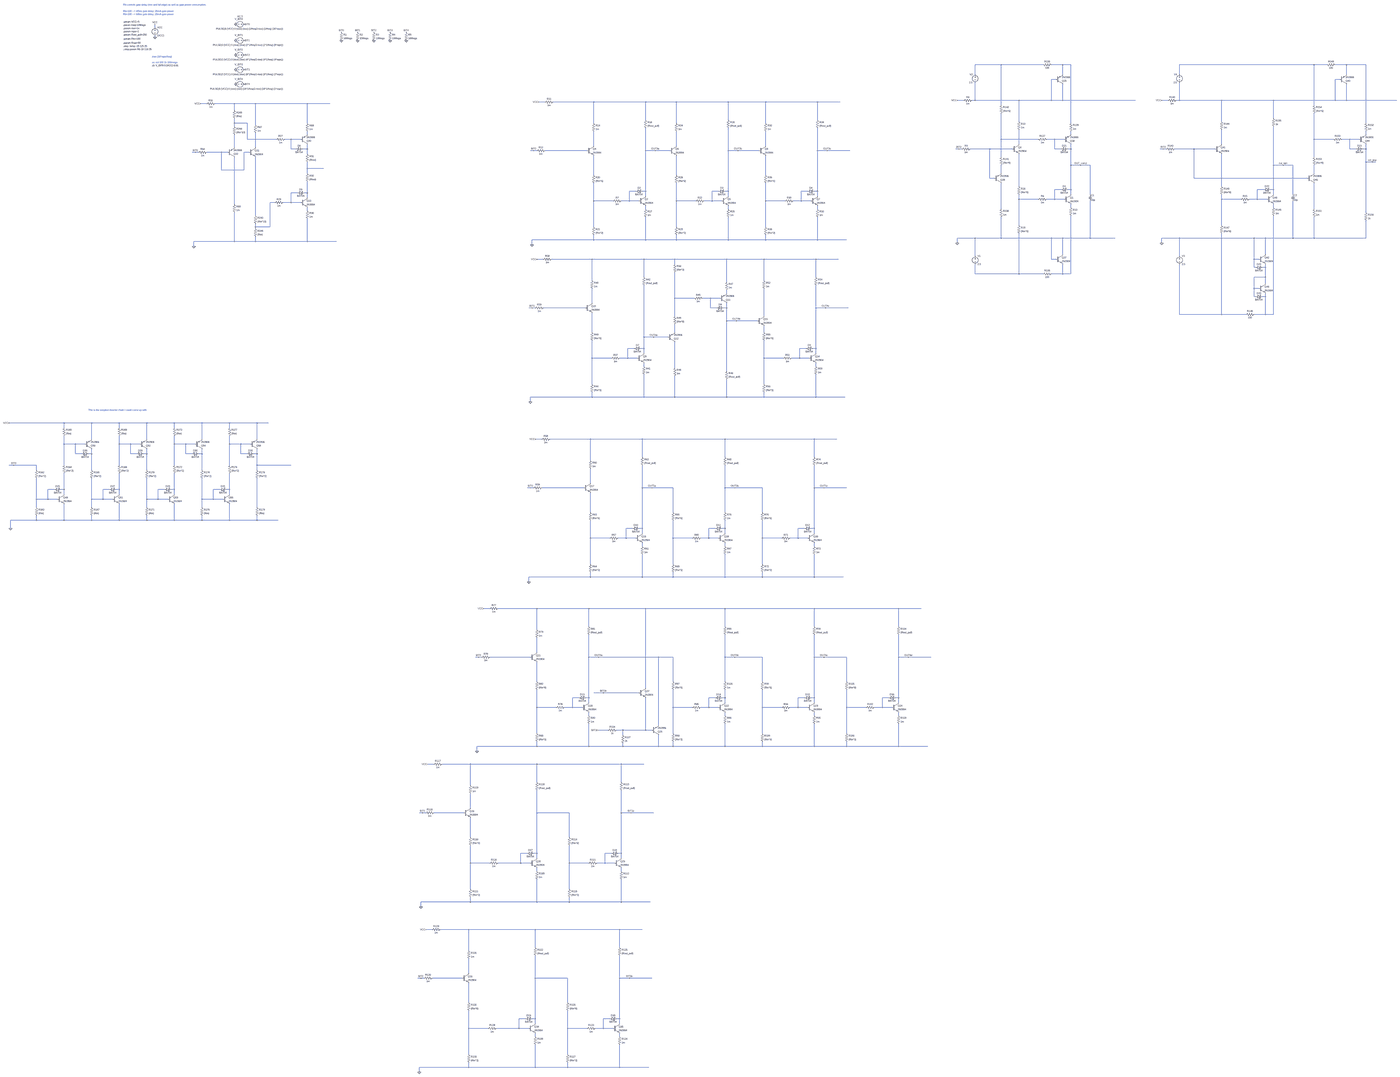
[diagram p0: schematic logic_gates.asc, whole sheet]
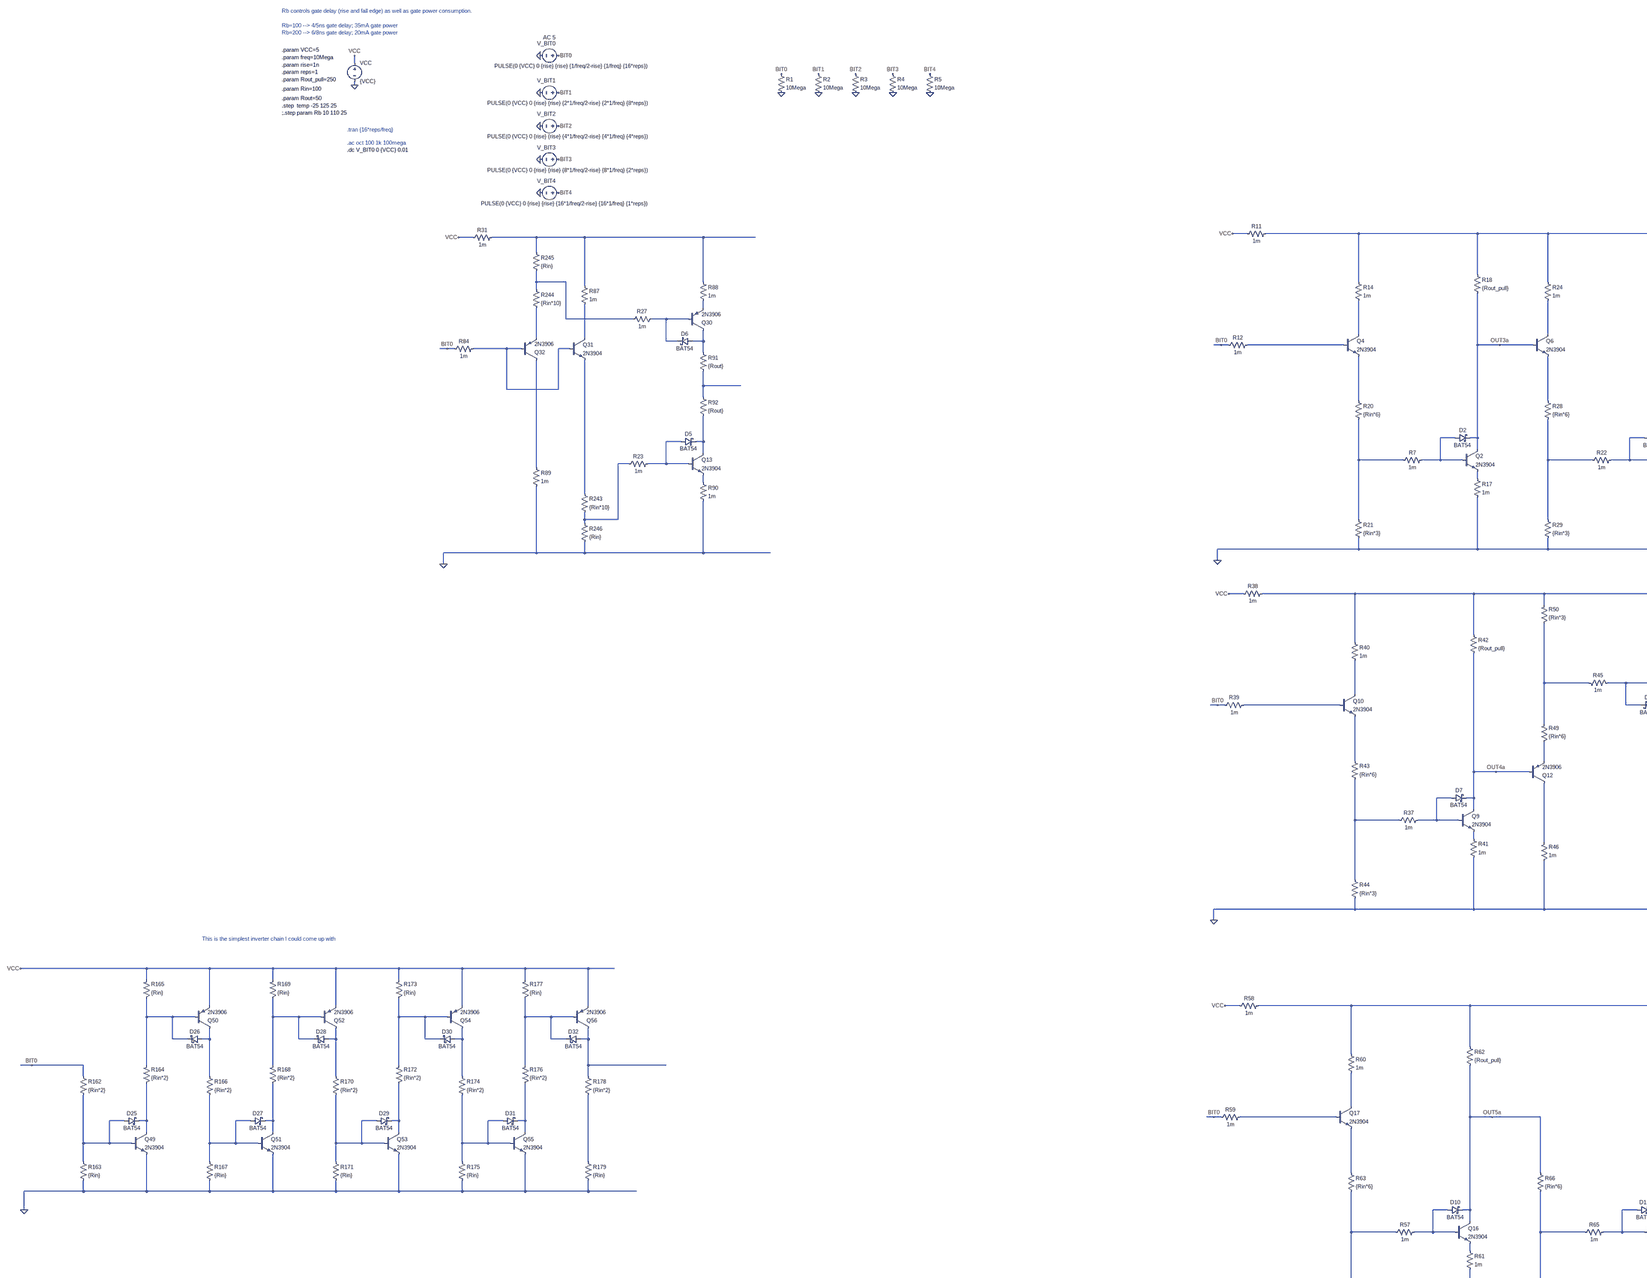
[diagram p1: schematic logic_gates.asc, part, row 1 of 2, column 1 of 2]
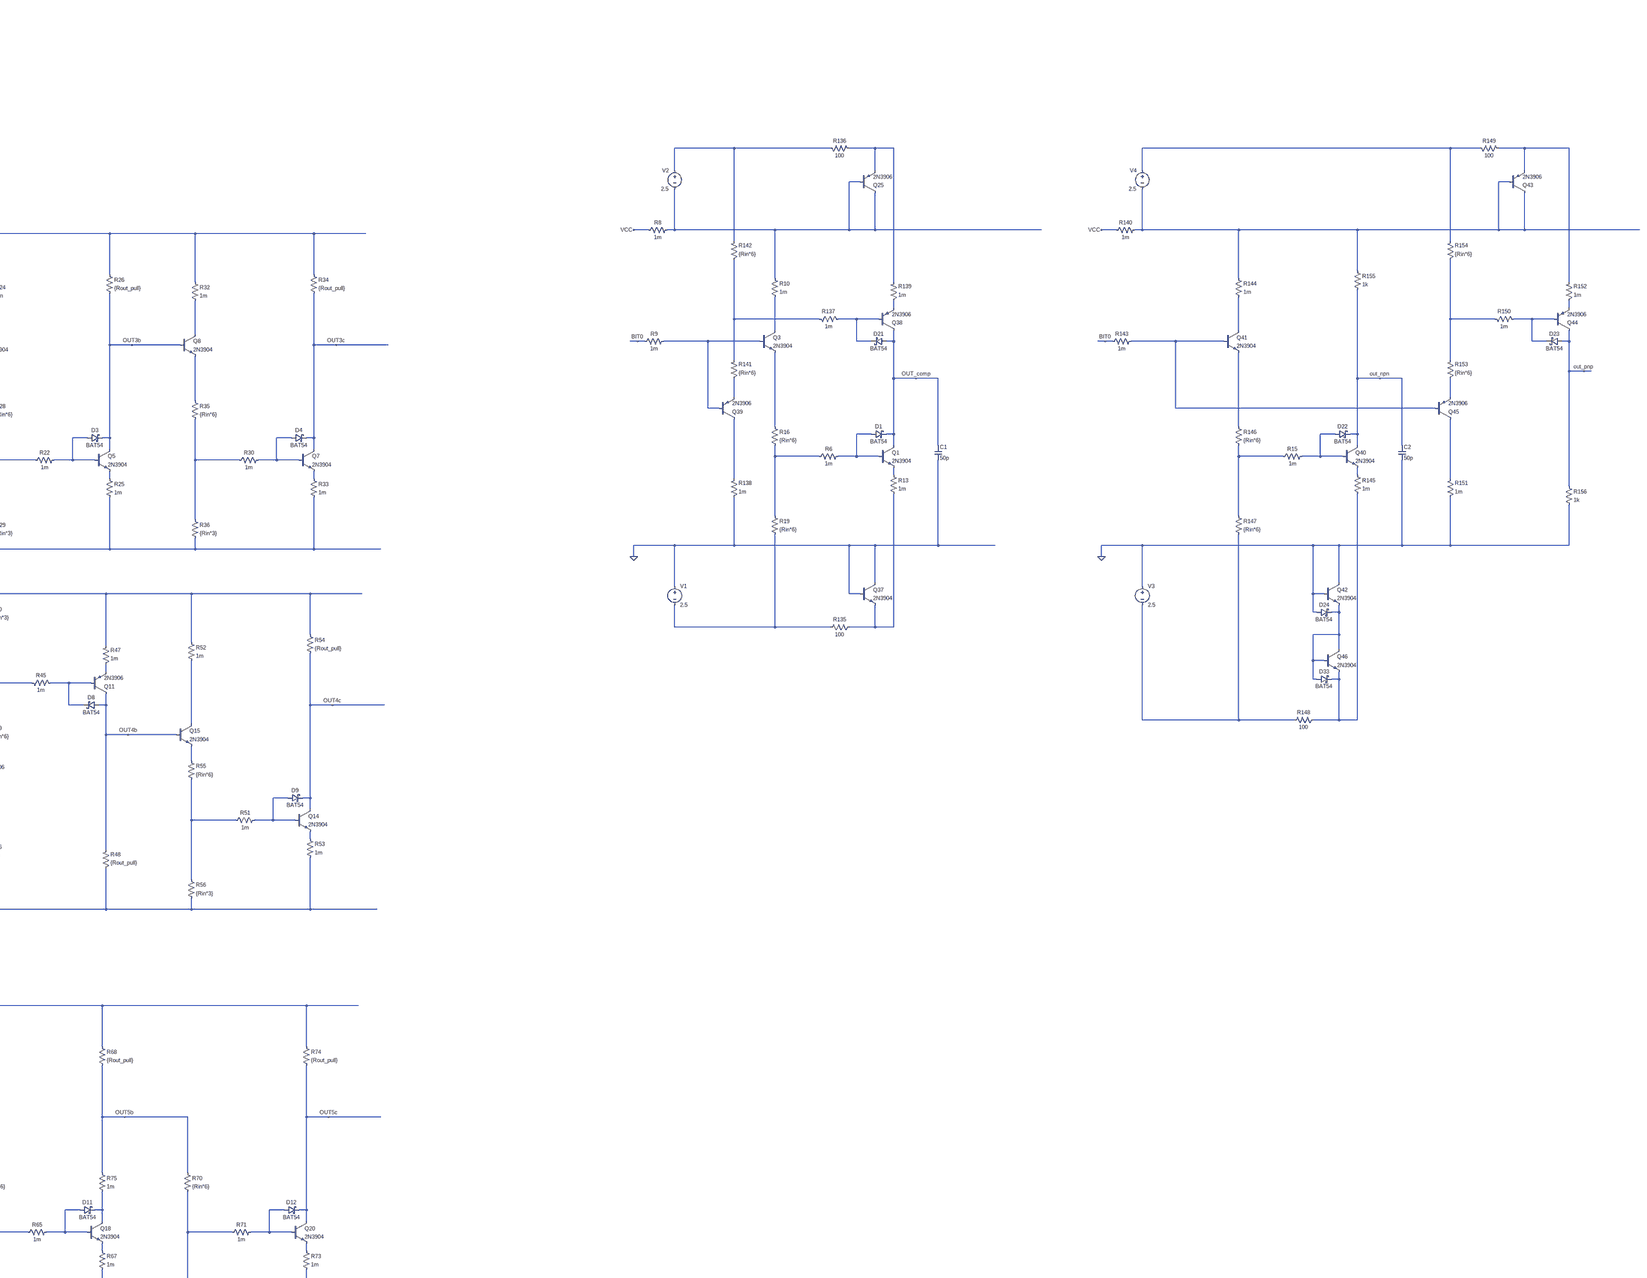
[diagram p2: schematic logic_gates.asc, part, row 1 of 2, column 2 of 2]
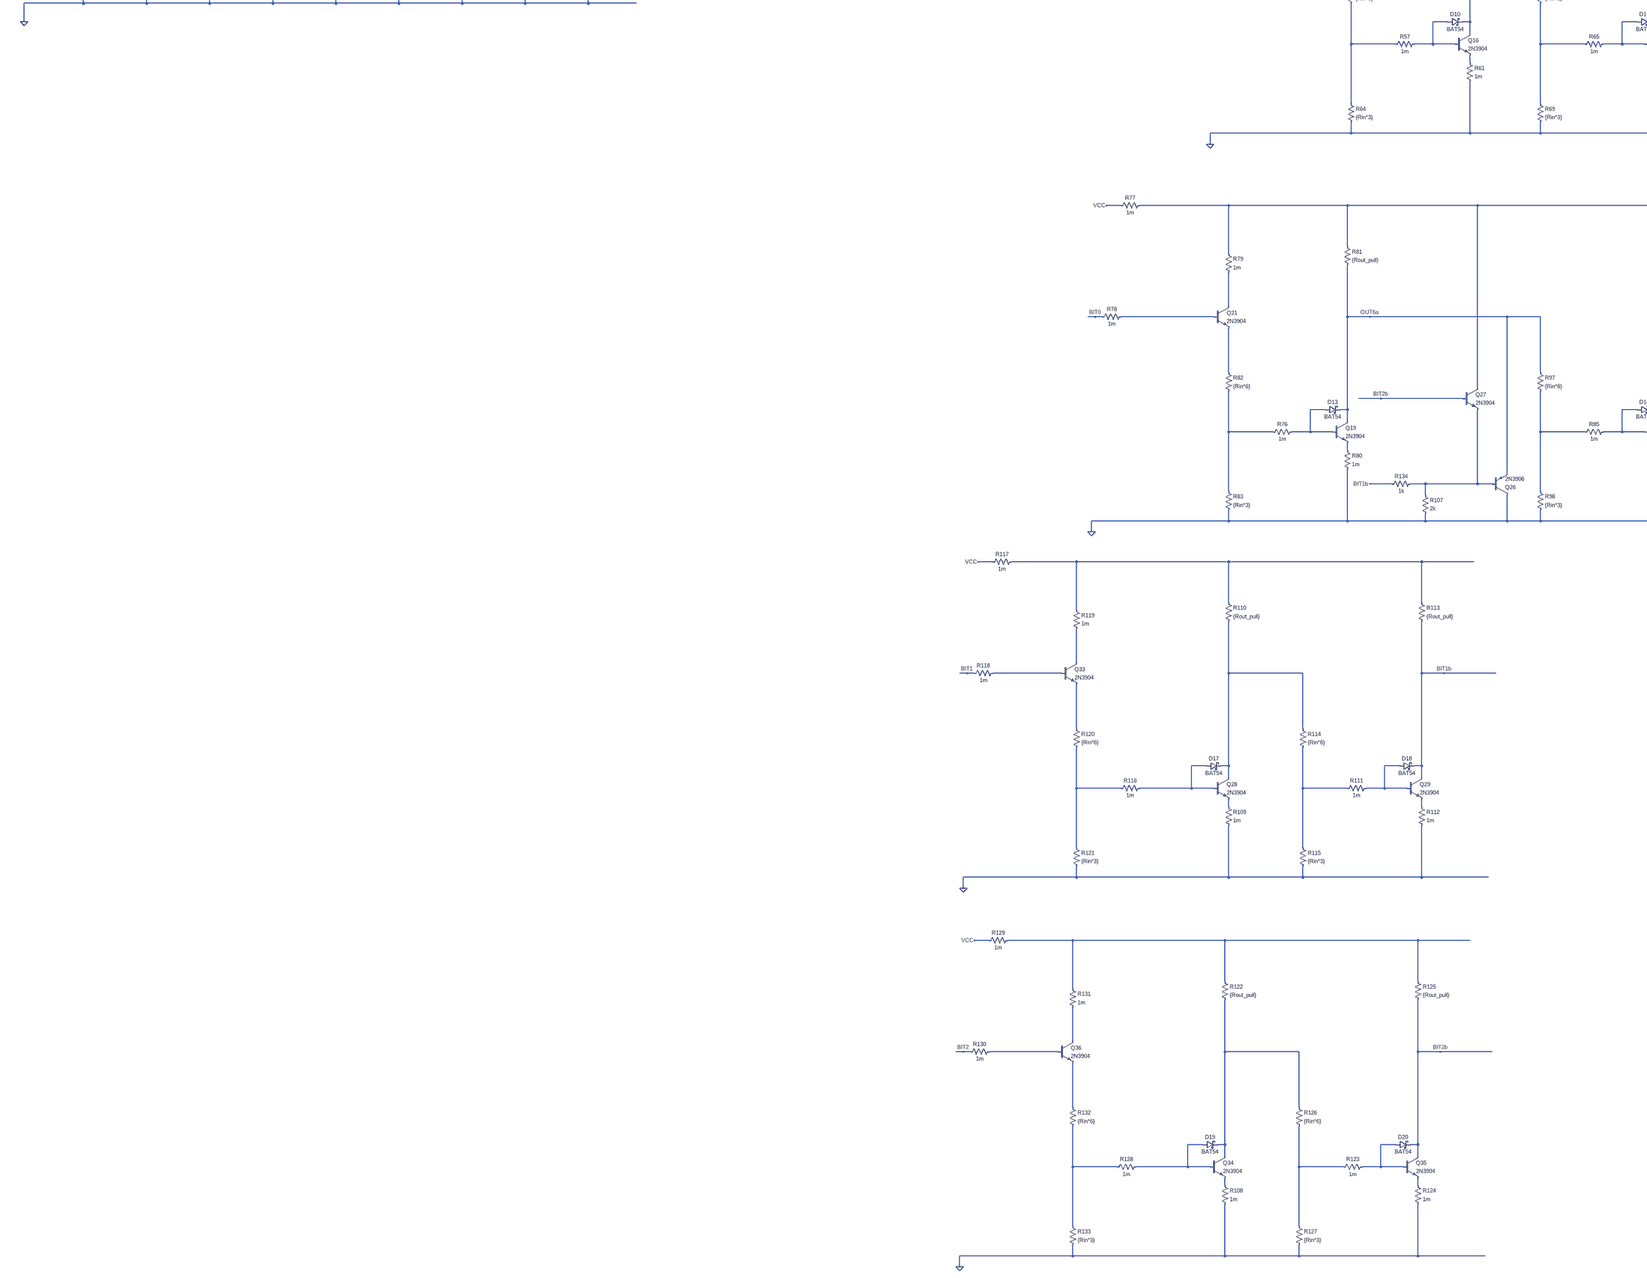
[diagram p3: schematic logic_gates.asc, part, row 2 of 2, column 1 of 2]
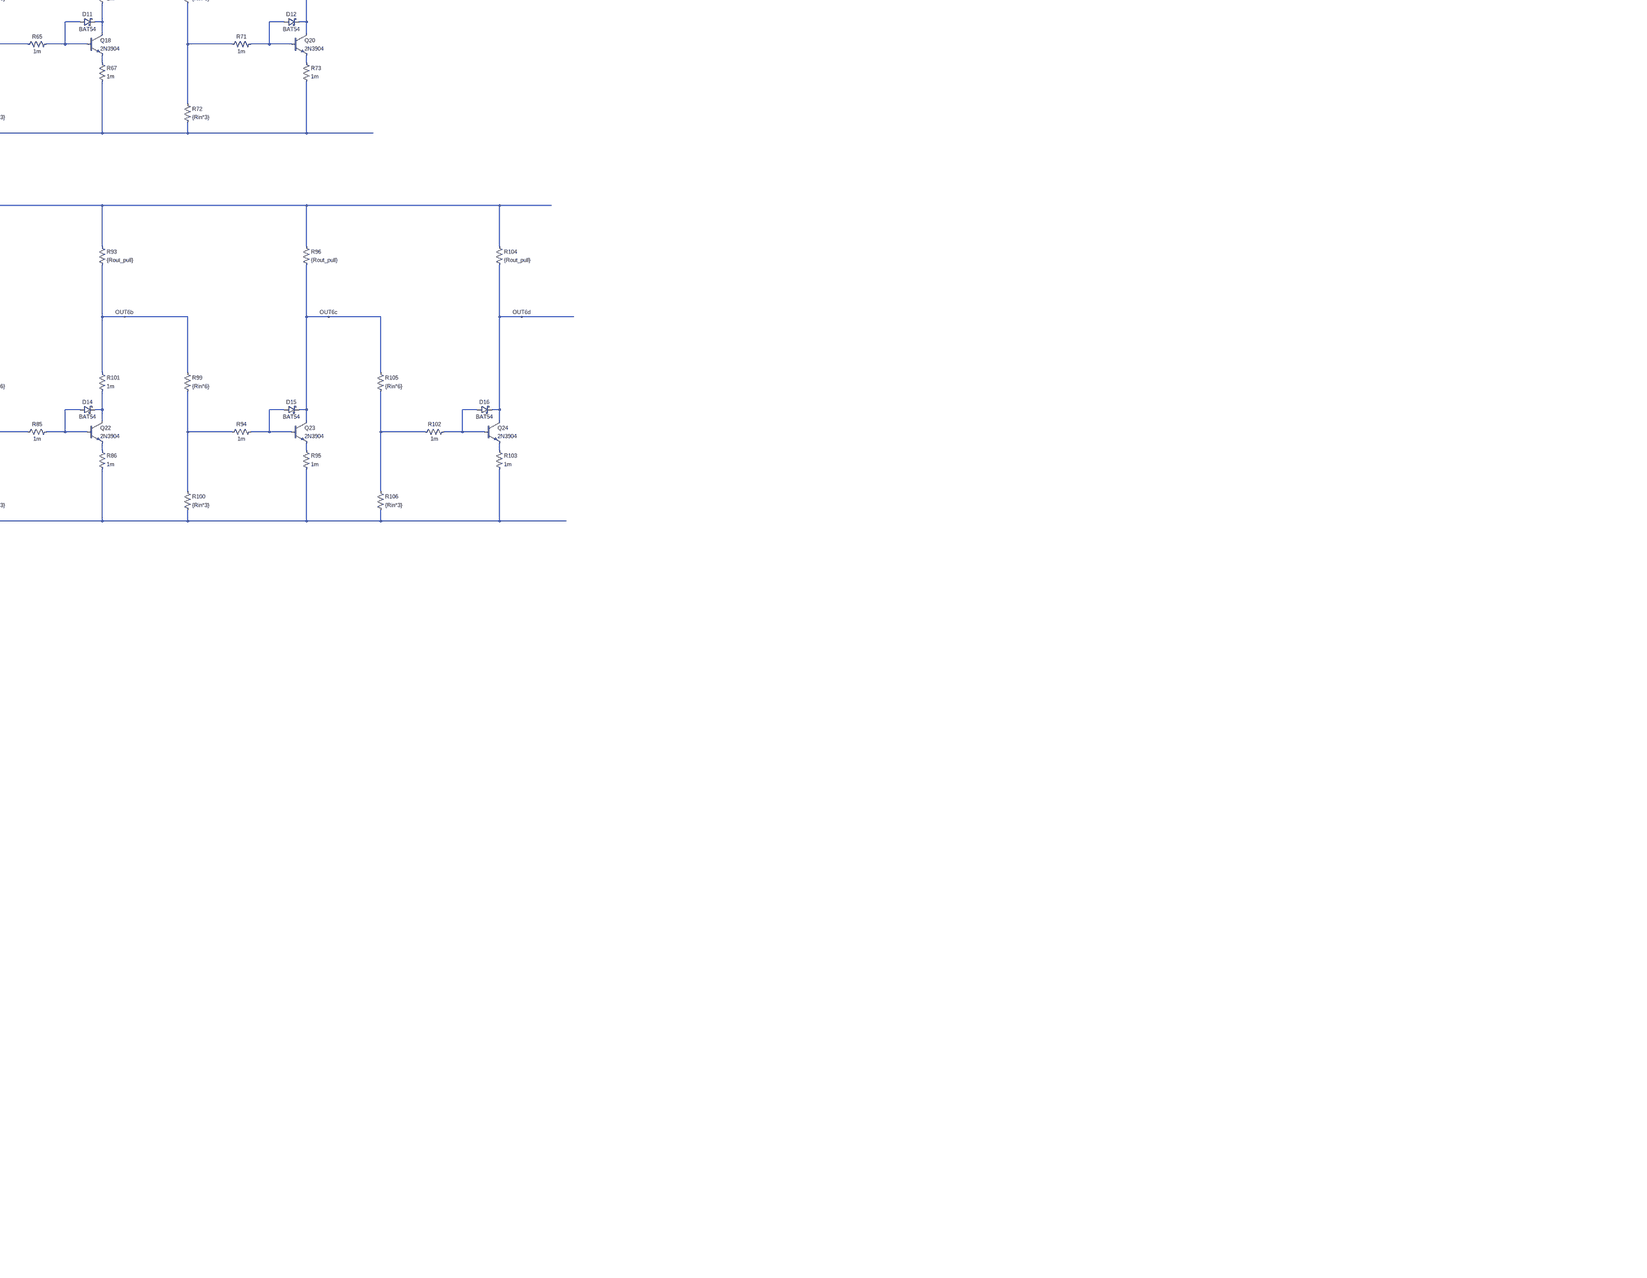
[diagram p4: schematic logic_gates.asc, part, row 2 of 2, column 2 of 2]
* logic_gates.asc
VCC VCC 0 {VCC}
V_BIT0 BIT0 0 PULSE(0 {VCC} 0 {rise} {rise} {1/freq/2-rise} {1/freq} {16*reps}) AC 5
V_BIT1 BIT1 0 PULSE(0 {VCC} 0 {rise} {rise} {2*1/freq/2-rise} {2*1/freq} {8*reps})
V_BIT2 BIT2 0 PULSE(0 {VCC} 0 {rise} {rise} {4*1/freq/2-rise} {4*1/freq} {4*reps})
V_BIT3 BIT3 0 PULSE(0 {VCC} 0 {rise} {rise} {8*1/freq/2-rise} {8*1/freq} {2*reps})
V_BIT4 BIT4 0 PULSE(0 {VCC} 0 {rise} {rise} {16*1/freq/2-rise} {16*1/freq} {1*reps})
R1 BIT0 0 10Mega
R2 BIT1 0 10Mega
R3 BIT2 0 10Mega
R4 BIT3 0 10Mega
R5 BIT4 0 10Mega
R23 N050 N043 1m
Q13 N044 N043 N059 0 2N3904
D5 N043 N044 BAT54
Q30 N025 N013 N010 0 2N3906
D6 N025 N013 BAT54
R27 N013 N009 1m
R31 VCC N008 1m
R84 BIT0 N029 1m
Q31 N024 N029 N060 0 2N3904
Q32 N051 N029 N023 0 2N3906
R87 N008 N024 1m
R88 N008 N010 1m
R89 N051 0 1m
R90 N059 0 1m
R91 N025 N030 {Rout}
R92 N030 N044 {Rout}
R243 N060 N050 {Rin*10}
R244 N009 N023 {Rin*10}
R245 N008 N009 {Rin}
R246 N050 0 {Rin}
R6 N045 N038 1m
Q1 OUT_comp N038 N052 0 2N3904
D1 N038 OUT_comp BAT54
R8 VCC N005 1m
R9 BIT0 N026 1m
Q3 N018 N026 N036 0 2N3904
R10 N005 N018 1m
R13 N052 N064 1m
R16 N036 N045 {Rin*6}
R19 N045 N063 {Rin*6}
C1 OUT_comp 0 50p
R7 N047 N040 1m
Q2 OUT3a N040 N054 0 2N3904
D2 N040 OUT3a BAT54
R11 VCC N007 1m
R12 BIT0 N028 1m
Q4 N020 N028 N033 0 2N3904
R14 N007 N020 1m
R17 N054 0 1m
R18 N007 OUT3a {Rout_pull}
R20 N033 N047 {Rin*6}
R21 N047 0 {Rin*3}
R22 N048 N041 1m
Q5 OUT3b N041 N055 0 2N3904
D3 N041 OUT3b BAT54
Q6 N021 OUT3a N034 0 2N3904
R24 N007 N021 1m
R25 N055 0 1m
R26 N007 OUT3b {Rout_pull}
R28 N034 N048 {Rin*6}
R29 N048 0 {Rin*3}
R30 N049 N042 1m
Q7 OUT3c N042 N056 0 2N3904
D4 N042 OUT3c BAT54
Q8 N022 OUT3b N035 0 2N3904
R32 N007 N022 1m
R33 N056 0 1m
R34 N007 OUT3c {Rout_pull}
R35 N035 N049 {Rin*6}
R36 N049 0 {Rin*3}
R37 N078 N076 1m
Q9 OUT4a N076 N080 0 2N3904
D7 N076 OUT4a BAT54
R38 VCC N061 1m
R39 BIT0 N070 1m
Q10 N069 N070 N073 0 2N3904
R40 N061 N069 1m
R41 N080 0 1m
R42 N061 OUT4a {Rout_pull}
R43 N073 N078 {Rin*6}
R44 N078 0 {Rin*3}
R45 N067 N068 1m
D8 OUT4b N068 BAT54
R46 0 N082 1m
R47 N065 N061 1m
R48 0 OUT4b {Rout_pull}
R49 N074 N067 {Rin*6}
R50 N067 N061 {Rin*3}
R51 N079 N077 1m
Q14 OUT4c N077 N081 0 2N3904
D9 N077 OUT4c BAT54
Q15 N072 OUT4b N075 0 2N3904
R52 N061 N072 1m
R53 N081 0 1m
R54 N061 OUT4c {Rout_pull}
R55 N075 N079 {Rin*6}
R56 N079 0 {Rin*3}
Q11 OUT4b N068 N065 0 2N3906
Q12 N082 OUT4a N074 0 2N3906
R57 N108 N104 1m
Q16 OUT5a N104 N111 0 2N3904
D10 N104 OUT5a BAT54
R58 VCC N083 1m
R59 BIT0 N093 1m
Q17 N092 N093 N103 0 2N3904
R60 N083 N092 1m
R61 N111 0 1m
R62 N083 OUT5a {Rout_pull}
R63 N103 N108 {Rin*6}
R64 N108 0 {Rin*3}
R65 N109 N105 1m
Q18 N106 N105 N112 0 2N3904
D11 N105 N106 BAT54
R67 N112 0 1m
R68 N083 OUT5b {Rout_pull}
R71 N110 N107 1m
Q20 OUT5c N107 N113 0 2N3904
D12 N107 OUT5c BAT54
R73 N113 0 1m
R74 N083 OUT5c {Rout_pull}
R66 OUT5a N109 {Rin*6}
R69 N109 0 {Rin*3}
R70 OUT5b N110 {Rin*6}
R72 N110 0 {Rin*3}
R75 OUT5b N106 1m
R76 N123 N118 1m
Q19 OUT6a N118 N127 0 2N3904
D13 N118 OUT6a BAT54
R77 VCC N114 1m
R78 BIT0 N116 1m
Q21 N115 N116 N117 0 2N3904
R79 N114 N115 1m
R80 N127 0 1m
R81 N114 OUT6a {Rout_pull}
R82 N117 N123 {Rin*6}
R83 N123 0 {Rin*3}
R85 N124 N119 1m
Q22 N120 N119 N128 0 2N3904
D14 N119 N120 BAT54
R86 N128 0 1m
R93 N114 OUT6b {Rout_pull}
R94 N125 N121 1m
Q23 OUT6c N121 N129 0 2N3904
D15 N121 OUT6c BAT54
R95 N129 0 1m
R96 N114 OUT6c {Rout_pull}
R97 OUT6a N124 {Rin*6}
R98 N124 0 {Rin*3}
R99 OUT6b N125 {Rin*6}
R100 N125 0 {Rin*3}
R101 OUT6b N120 1m
R102 N126 N122 1m
Q24 OUT6d N122 N130 0 2N3904
D16 N122 OUT6d BAT54
R103 N130 0 1m
R104 N114 OUT6d {Rout_pull}
R105 OUT6c N126 {Rin*6}
R106 N126 0 {Rin*3}
R107 N131 0 2k
Q26 0 N131 OUT6a 0 2N3906
Q27 N114 BIT2b N131 0 2N3904
Q28 N135 N137 N141 0 2N3904
D17 N137 N135 BAT54
R109 N141 0 1m
R110 N132 N135 {Rout_pull}
R111 N140 N138 1m
Q29 BIT1b N138 N142 0 2N3904
D18 N138 BIT1b BAT54
R112 N142 0 1m
R113 N132 BIT1b {Rout_pull}
R114 N135 N140 {Rin*6}
R115 N140 0 {Rin*3}
R116 N139 N137 1m
R117 VCC N132 1m
R118 BIT1 N134 1m
Q33 N133 N134 N136 0 2N3904
R119 N132 N133 1m
R120 N136 N139 {Rin*6}
R121 N139 0 {Rin*3}
Q34 N146 N148 N152 0 2N3904
D19 N148 N146 BAT54
R108 N152 0 1m
R122 N143 N146 {Rout_pull}
R123 N151 N149 1m
Q35 BIT2b N149 N153 0 2N3904
D20 N149 BIT2b BAT54
R124 N153 0 1m
R125 N143 BIT2b {Rout_pull}
R126 N146 N151 {Rin*6}
R127 N151 0 {Rin*3}
R128 N150 N148 1m
R129 VCC N143 1m
R130 BIT2 N145 1m
Q36 N144 N145 N147 0 2N3904
R131 N143 N144 1m
R132 N147 N150 {Rin*6}
R133 N150 0 {Rin*3}
R134 BIT1b N131 1k
V1 0 N063 2.5
R135 N064 N063 100
Q37 0 0 N064 0 2N3904
V2 N001 N005 2.5
R136 N002 N001 100
Q25 N005 N005 N002 0 2N3906
R137 N014 N015 1m
D21 OUT_comp N015 BAT54
R138 0 N057 1m
R139 N011 N002 1m
R141 N031 N014 {Rin*6}
R142 N014 N001 {Rin*6}
Q38 OUT_comp N015 N011 0 2N3906
Q39 N057 N026 N031 0 2N3906
R15 N046 N039 1m
Q40 out_npn N039 N053 0 2N3904
D22 N039 out_npn BAT54
R140 VCC N006 1m
R143 BIT0 N027 1m
Q41 N019 N027 N037 0 2N3904
R144 N006 N019 1m
R145 N053 N066 1m
R146 N037 N046 {Rin*6}
R147 N046 N071 {Rin*6}
C2 out_npn 0 50p
V3 0 N071 2.5
R148 N066 N071 100
Q42 0 0 N062 0 2N3904
V4 N003 N006 2.5
R149 N004 N003 100
Q43 N006 N006 N004 0 2N3906
R150 N016 N017 1m
D23 out_pnp N017 BAT54
R151 0 N058 1m
R152 N012 N004 1m
R153 N032 N016 {Rin*6}
R154 N016 N003 {Rin*6}
Q44 out_pnp N017 N012 0 2N3906
Q45 N058 N027 N032 0 2N3906
R155 N006 out_npn 1k
R156 out_pnp 0 1k
Q49 N095 N094 0 0 2N3904
D25 N094 N095 BAT54
R162 BIT0 N094 {Rin*2}
R163 N094 0 {Rin}
D26 N088 N084 BAT54
R164 N095 N084 {Rin*2}
R165 N084 VCC {Rin}
Q50 N088 N084 VCC 0 2N3906
R166 N088 N096 {Rin*2}
R167 N096 0 {Rin}
Q51 N097 N096 0 0 2N3904
D27 N096 N097 BAT54
D28 N089 N085 BAT54
R168 N097 N085 {Rin*2}
R169 N085 VCC {Rin}
Q52 N089 N085 VCC 0 2N3906
R170 N089 N098 {Rin*2}
R171 N098 0 {Rin}
Q53 N099 N098 0 0 2N3904
D29 N098 N099 BAT54
D30 N090 N086 BAT54
R172 N099 N086 {Rin*2}
R173 N086 VCC {Rin}
Q54 N090 N086 VCC 0 2N3906
R174 N090 N100 {Rin*2}
R175 N100 0 {Rin}
Q55 N101 N100 0 0 2N3904
D31 N100 N101 BAT54
D32 N091 N087 BAT54
R176 N101 N087 {Rin*2}
R177 N087 VCC {Rin}
Q56 N091 N087 VCC 0 2N3906
R178 N091 N102 {Rin*2}
R179 N102 0 {Rin}
D24 0 N062 BAT54
Q46 N062 N062 N066 0 2N3904
D33 N062 N066 BAT54
.model D D
.lib standard.dio
.model NPN NPN
.model PNP PNP
.lib standard.bjt
* .tran {16*reps/freq}
* .ac oct 100 1k 100mega
.dc V_BIT0 0 {VCC} 0.01
.param VCC=5
.param freq=10Mega
.param rise=1n
.param reps=1
.param Rout_pull=250
* Rb controls gate delay (rise and fall edge) as well as gate power consumption.
* Rb=100 --> 4/5ns gate delay; 35mA gate power
* Rb=200 --> 6/8ns gate delay; 20mA gate power
.param Rin=100
.param Rout=50
.step  temp -25 125 25
;.step param Rb 10 110 25
* This is the simplest inverter chain I could come up with
.backanno
.end